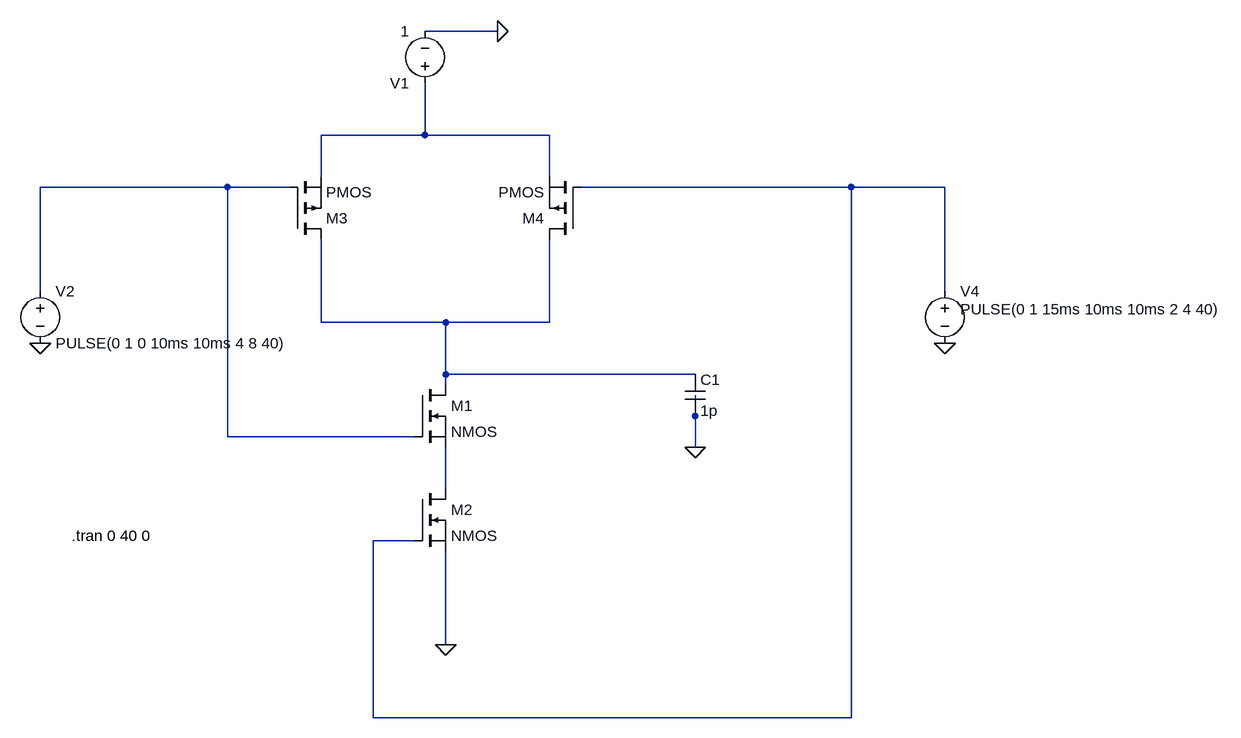
[diagram p0: schematic nand_gate.asc]
nand_gate.asc, the LTspice schematic file:
Version 4
SHEET 1 1264 772
WIRE 112 -288 0 -288
WIRE 0 -128 0 -208
WIRE 0 -128 -160 -128
WIRE 192 -128 0 -128
WIRE -160 -64 -160 -128
WIRE 192 -64 192 -128
WIRE -304 -48 -592 -48
WIRE -208 -48 -304 -48
WIRE 656 -48 240 -48
WIRE 800 -48 656 -48
WIRE -592 112 -592 -48
WIRE 800 112 800 -48
WIRE -160 160 -160 32
WIRE 32 160 -160 160
WIRE 192 160 192 32
WIRE 192 160 32 160
WIRE 32 240 32 160
WIRE 416 240 32 240
WIRE 32 256 32 240
WIRE 416 304 416 272
WIRE -304 336 -304 -48
WIRE -16 336 -304 336
WIRE 416 352 416 304
WIRE 32 416 32 352
WIRE -16 496 -80 496
WIRE 32 656 32 512
WIRE -80 768 -80 496
WIRE 656 768 656 -48
WIRE 656 768 -80 768
FLAG 32 656 0
FLAG 112 -288 0
FLAG -592 192 0
FLAG 800 192 0
FLAG 416 352 0
SYMBOL nmos -16 256 R0
SYMATTR InstName M1
SYMBOL nmos -16 416 R0
SYMATTR InstName M2
SYMBOL pmos -208 32 M180
SYMATTR InstName M3
SYMBOL pmos 240 32 R180
SYMATTR InstName M4
SYMBOL voltage 0 -192 R180
WINDOW 123 0 0 Left 2
WINDOW 39 0 0 Left 2
SYMATTR InstName V1
SYMATTR Value 1
SYMBOL voltage -592 96 R0
WINDOW 123 0 0 Left 2
WINDOW 39 0 0 Left 2
SYMATTR InstName V2
SYMATTR Value PULSE(0 1 0 10ms 10ms 4 8 40)
SYMBOL voltage 800 96 R0
WINDOW 3 24 44 Left 2
WINDOW 123 0 0 Left 2
WINDOW 39 0 0 Left 2
SYMATTR Value PULSE(0 1 15ms 10ms 10ms 2 4 40)
SYMATTR InstName V4
SYMBOL cap 400 240 R0
SYMATTR InstName C1
SYMATTR Value 1p
TEXT -544 488 Left 2 !.tran 0 40 0

The netlist it stands for:
* nand_gate.asc
M1 N004 N002 N005 N005 NMOS
M2 N005 N003 0 0 NMOS
M3 N004 N002 N001 N001 PMOS
M4 N004 N003 N001 N001 PMOS
V1 N001 0 1
V2 N002 0 PULSE(0 1 0 10ms 10ms 4 8 40)
V4 N003 0 PULSE(0 1 15ms 10ms 10ms 2 4 40)
C1 N004 0 1p
.model NMOS NMOS
.model PMOS PMOS
.lib standard.mos
.tran 0 40 0
.backanno
.end